# EAGLE schematic Servo_Word_Clock_LED_board_u_v1 (EAGLE 9.4.2)
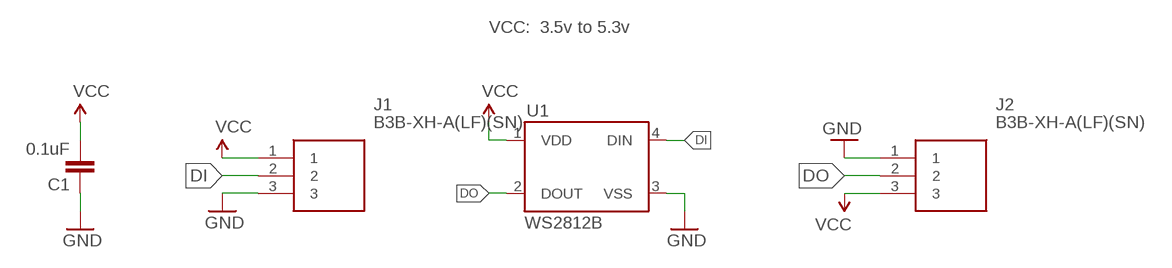
[diagram p0: schematic, sheet 1]

## Parts
C1  0.1uF  0.1UF-25V(+80/-20%)(0603)  [0603-CAP]
J1  B3B-XH-A(LF)(SN)  [SHDR3W64P0X250_1X3_990X575X700]
J2  B3B-XH-A(LF)(SN)  [SHDR3W64P0X250_1X3_990X575X700]
U1  WS2812B  [WS2812B]

## Nets
DI: J1.2 U1.4(DIN)
DO: J2.2 U1.2(DOUT)
GND: C1.1 J1.3 J2.1 U1.3(VSS)
VCC: C1.2 J1.1 J2.3 U1.1(VDD)

## Notes on the sheet
- VCC:  3.5v to 5.3v

## Library data of the parts
C1 = SparkFun-Capacitors:0.1UF-25V(+80/-20%)(0603): CAP-00810 Ceramic Standard decoupling cap; PROD_ID: CAP-00810
J1 J2 = SamacSys_Parts:B3B-XH-A(LF)(SN): XH-2.5mm Header top entry 3 way JST XH Series, Series Number B3B, 2.5mm Pitch 3 Way 1 Row Straight PCB Header, Solder Termination, 3A Source: Datasheet <http://docs-emea.rs-online.com/webdocs/1357/0900766b81357f2f.pdf>; DESCRIPTION: XH-2.5mm Header top entry 3 way JST XH Series, Series Number B3B, 2.5mm Pitch 3 Way 1 Row Straight PCB Header, Solder Termination, 3A; HEIGHT: 7mm; MANUFACTURER_NAME: JST (JAPAN SOLDERLESS TERMINALS); MANUFACTURER_PART_NUMBER: B3B-XH-A(LF)(SN); RS_PART_NUMBER: 8201557P; RS_PRICE-STOCK: http://uk.rs-online.com/web/p/products/8201557P
U1 = SparkFun-LED:WS2812B: WS2812B - Intelligent control LED integrated light source Technical Specifications: Power Supply Voltage (VDD): 3.5 to 5.3 V Input Voltage (VI): -0.5 to VDD+0.5 V Operating Junction Temperature (Topt): -25°C to +80°C Storage Temperature Range (Tstg): -55°C to +150°C; PROD_ID: DIO-12503